# Altium project Medusa-AI-ESP.PrjPcb
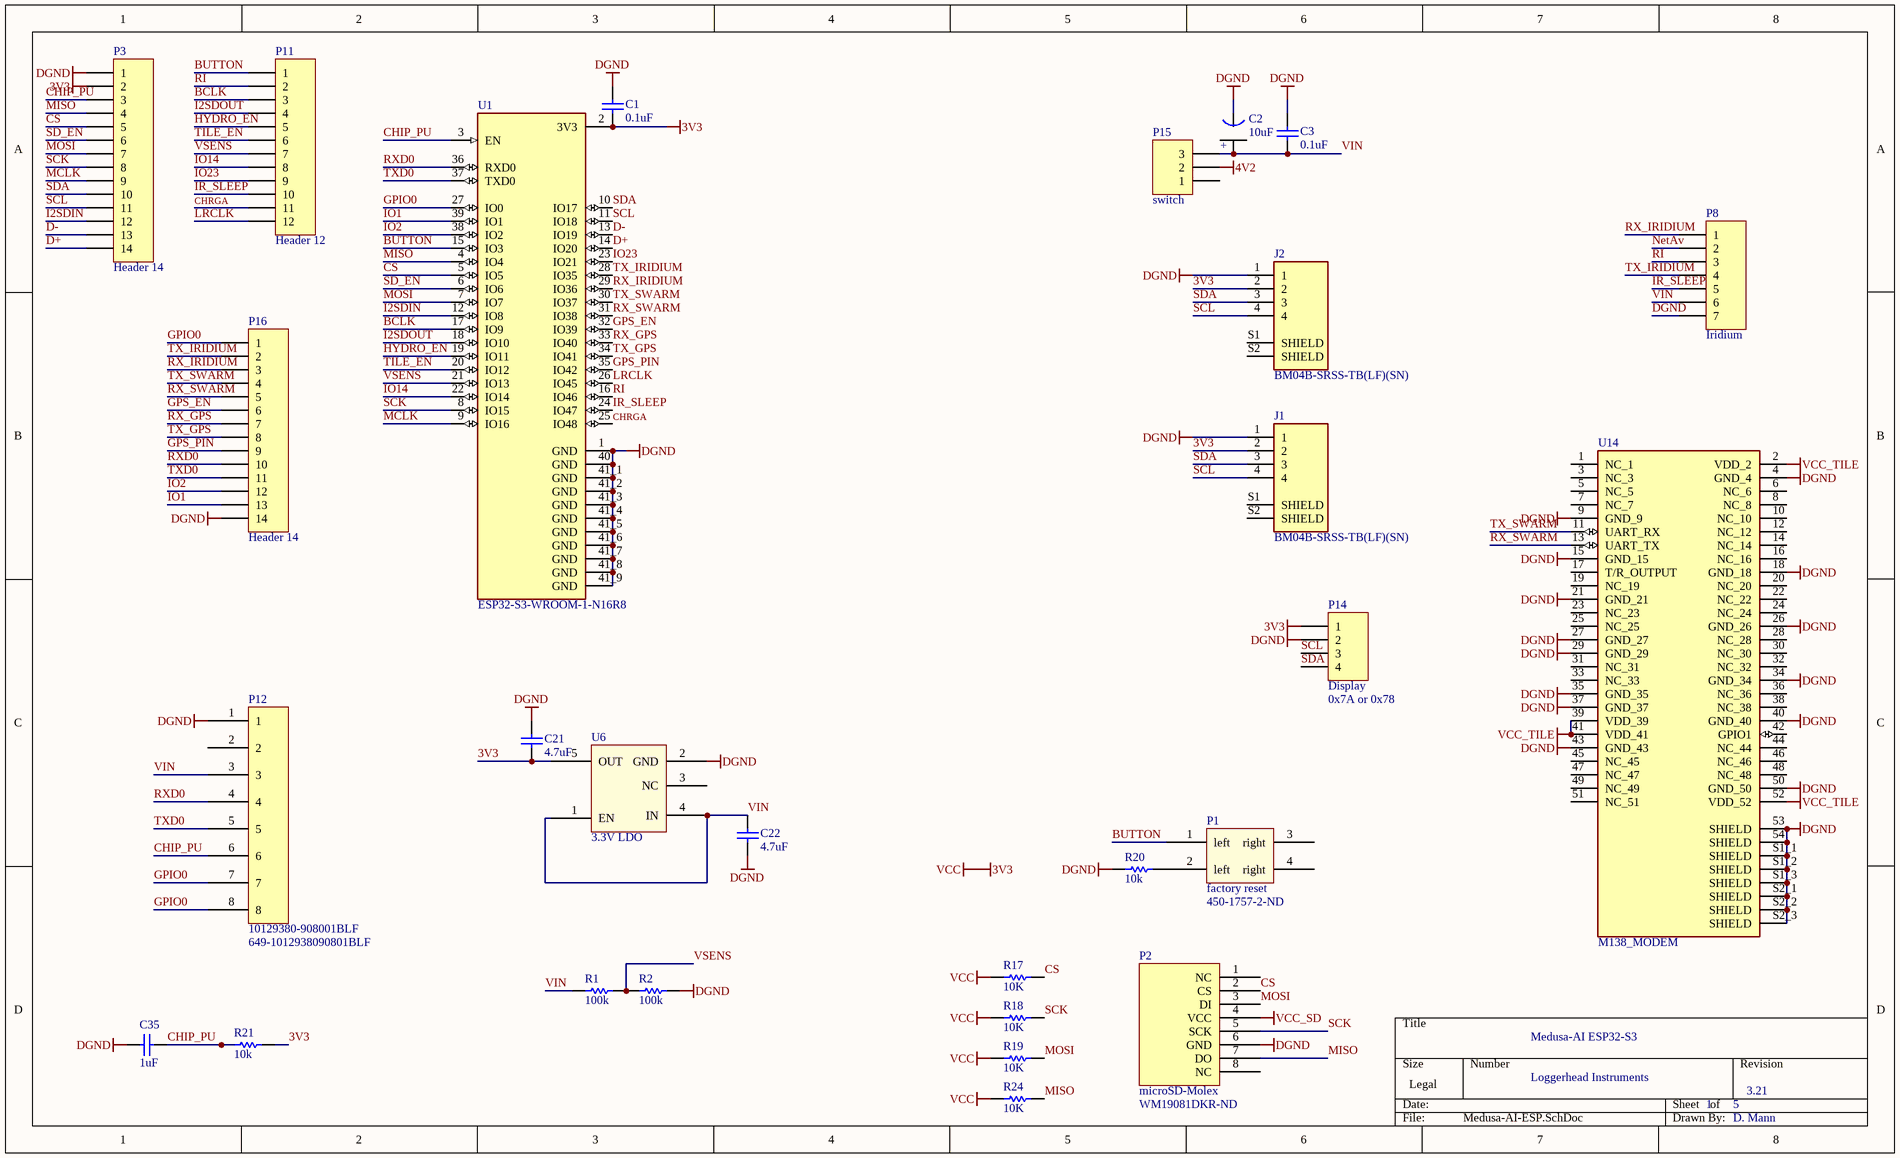
[diagram p0: Medusa-AI-ESP.SchDoc]
5 sheets, 124 parts. Net scope: global (net labels, ports and power ports of the same name join across sheets).
Board file: Medusa-AI-ESP.PcbDoc
Sheets:
  Medusa-AI-ESP.SchDoc
  medusa-ai-audio.SchDoc
  medusa-ai-power.SchDoc
  medusa-ai-sensors.SchDoc
  medusa-charger.SchDoc

## Sheet Medusa-AI-ESP.SchDoc
size Legal; SheetNumber: 1; SheetTotal: 5

### Parts
C1  0.1uF  [0402]
C2  10uF  [Tant0805]
C3  0.1uF  [0402]
C21  4.7uF  [0402]
C22  4.7uF  [0402]
C35  1uF  [0402]
J1  BM04B-SRSS-TB(LF)(SN)  [CONN_BM04B-SRSS-TB(LF)(SN)]
J2  BM04B-SRSS-TB(LF)(SN)  [CONN_BM04B-SRSS-TB(LF)(SN)]
P1  factory reset  Supplier Part Number 1: 450-1757-2-ND  [SOP4]
P2  microSD-Molex  Supplier Part Number 1: WM19081DKR-ND  [microSD_Molex_hinged]
P3  Header 14  [HDR1X14]
P8  Iridium  [HDR1X7]
P11  Header 12  [HDR1X12]
P12  10129380-908001BLF  Supplier Part Number 1: 649-1012938090801BLF  [Header_8_SMT]
P14  Display  [HDR1X4]
P15  switch  [HDR1X3]
P16  Header 14  [HDR1X14]
R1  100k  [3-0603]
R2  100k  [3-0603]
R17  10K  [3-0603]
R18  10K  [3-0603]
R19  10K  [3-0603]
R20  10k  [2-0402]
R21  10k  [2-0402]
R24  10K  [3-0603]
U1  ESP32-S3-WROOM-1-N16R8  [XCVR_ESP32-S3-WROOM-1-N16R2]
U6  3.3V LDO  [AP7361C-33Y5-13]
U14  M138_MODEM  [XCVR_M138_MODEM]

### Nets
3V3: C1.1 C21.2 J1.2 J2.2 P3.2 P14.1 R17.1 R18.1 R19.1 R21.1 R24.1 U1.2(3V3) U6.5(OUT)  [also labelled VCC]
4V2: P15.2
DGND: C1.2 C2.1(GND) C3.2 C21.1 C22.2 C35.2 J1.1 J2.1 P2.6(GND) P3.1 P8.7 P12.1 P14.2 P16.14 R2.1 R20.2 U1.1(GND) U1.40(GND) U1.41_1(GND) U1.41_2(GND) U1.41_3(GND) U1.41_4(GND) U1.41_5(GND) U1.41_6(GND) U1.41_7(GND) U1.41_8(GND) U1.41_9(GND) U6.2(GND) U14.4(GND_4) U14.9(GND_9) U14.15(GND_15) U14.18(GND_18) U14.21(GND_21) U14.26(GND_26) U14.27(GND_27) U14.29(GND_29) U14.34(GND_34) U14.35(GND_35) U14.37(GND_37) U14.40(GND_40) U14.43(GND_43) U14.50(GND_50) U14.53(SHIELD) U14.54(SHIELD) U14.S1_1(SHIELD) U14.S1_2(SHIELD) U14.S1_3(SHIELD) U14.S2_1(SHIELD) U14.S2_2(SHIELD) U14.S2_3(SHIELD)
VCC_SD: P2.4(VCC)
VCC_TILE: U14.2(VDD_2) U14.39(VDD_39) U14.41(VDD_41) U14.52(VDD_52)
BCLK: P11.3 U1.17(IO9)
BUTTON: P1.1(left) P11.1 U1.15(IO3)
CHIP_PU: C35.1 P3.3 P12.6 R21.2 U1.3(EN)
CHRGA: P11.11 U1.25(IO48)
CS: P2.2(CS) P3.5 R17.2 U1.5(IO5)
D+: P3.14 U1.14(IO20)
D-: P3.13 U1.13(IO19)
GPIO0: P12.7 P12.8 P16.1 U1.27(IO0)
GPS_EN: P16.6 U1.32(IO39)
GPS_PIN: P16.9 U1.35(IO42)
HYDRO_EN: P11.5 U1.19(IO11)
I2SDIN: P3.12 U1.12(IO8)
I2SDOUT: P11.4 U1.18(IO10)
IO1: P16.13 U1.39(IO1)
IO2: P16.12 U1.38(IO2)
IO14: P11.8 U1.22(IO14)
IO23: P11.9 U1.23(IO21)
IR_SLEEP: P8.5 P11.10 U1.24(IO47)
LRCLK: P11.12 U1.26(IO45)
MCLK: P3.9 U1.9(IO16)
MISO: P2.7(DO) P3.4 R24.2 U1.4(IO4)
MOSI: P2.3(DI) P3.7 R19.2 U1.7(IO7)
NetAv: P8.2
RI: P8.3 P11.2 U1.16(IO46)
RX_GPS: P16.7 U1.33(IO40)
RX_IRIDIUM: P8.1 P16.3 U1.29(IO36)
RX_SWARM: P16.5 U1.31(IO38) U14.13(UART_TX)
RXD0: P12.4 P16.10 U1.36(RXD0)
SCK: P2.5(SCK) P3.8 R18.2 U1.8(IO15)
SCL: J1.4 J2.4 P3.11 P14.3 U1.11(IO18)
SD_EN: P3.6 U1.6(IO6)
SDA: J1.3 J2.3 P3.10 P14.4 U1.10(IO17)
TILE_EN: P11.6 U1.20(IO12)
TX_GPS: P16.8 U1.34(IO41)
TX_IRIDIUM: P8.4 P16.2 U1.28(IO35)
TX_SWARM: P16.4 U1.30(IO37) U14.11(UART_RX)
TXD0: P12.5 P16.11 U1.37(TXD0)
VIN: C2.2(+) C3.1 C22.1 P8.6 P12.3 P15.3 R1.2 U6.1(EN) U6.4(IN)
VSENS: P11.7 R1.1 R2.2 U1.21(IO13)
NetP1_2: P1.2(left) R20.1

Not connected (* = marked no-connect by the designer): J1 S1(SHIELD) S2(SHIELD); J2 S1(SHIELD) S2(SHIELD); P1 3(right) 4(right); P2 1(NC) 8(NC); P12 2; P15 1; U6 3(NC); U14 1(NC_1) 3(NC_3) 5(NC_5) 6(NC_6) 7(NC_7) 8(NC_8) 10(NC_10) 12(NC_12) 14(NC_14) 16(NC_16) 17(T/R_OUTPUT) 19(NC_19) 20(NC_20) 22(NC_22) 23(NC_23) 24(NC_24) 25(NC_25) 28(NC_28) 30(NC_30) 31(NC_31) 32(NC_32) 33(NC_33) 36(NC_36) 38(NC_38) 42(GPIO1) 44(NC_44) 45(NC_45) 46(NC_46) 47(NC_47) 48(NC_48) 49(NC_49) 51(NC_51)

### Notes on the sheet
- (near P14) 0x7A or 0x78
- Medusa-AI ESP32-S3
- Loggerhead Instruments
- 1
- 5
- 3.21
- D. Mann

### Library data of the parts
C1 C3 = C0402: Ceramic Chip Capacitor - Standard; Note: Footprint corresponds to dimensions for bulk cassette packaging. This case size has tightened tolerances.; Published: 17-Jul-2002; LatestRevisionDate: 19-Mar-2004; LatestRevisionNote: Silkscreen size reduced.; DatasheetDocument: Mar-2001; PackageDocument: Mar-2001; PackageReference: 0402; Publisher: Altium Limited; Code_JEITA: 0402; Code_IPC: 1005 [0402]; ComponentLink1Description: Manufacturer Link; ComponentLink1URL: http://www.kemet.com/; ComponentLink2Description: Datasheet; ComponentLink2URL: http://www.kemet.com/kemet/web/homepage/kechome.nsf/vapubfilesname/F3102TA.pdf/$file/F3102TA.pdf; Value: 0.1uF
C2 = Tant0805: Value: 10uF
C21 C22 C35 = C0402: Ceramic Chip Capacitor - Standard; Note: Footprint corresponds to dimensions for bulk cassette packaging. This case size has tightened tolerances.; Value: 0.1uF; Published: 17-Jul-2002; LatestRevisionDate: 19-Mar-2004; LatestRevisionNote: Silkscreen size reduced.; DatasheetDocument: Mar-2001; PackageDocument: Mar-2001; PackageReference: 0402; Publisher: Altium Limited; Code_JEITA: 0402; Code_IPC: 1005 [0402]; ComponentLink1Description: Manufacturer Link; ComponentLink1URL: http://www.kemet.com/; ComponentLink2Description: Datasheet; ComponentLink2URL: http://www.kemet.com/kemet/web/homepage/kechome.nsf/vapubfilesname/F3102TA.pdf/$file/F3102TA.pdf
J1 J2 = BM04B-SRSS-TB(LF)(SN): Connector Header Surface Mount 4 position 0.039 _1.00mm_; MF: JST Sales; MP: BM04B-SRSS-TB_LF__SN_; Price: None; Availability: Unavailable; Package: None; SnapEDA_Link: https://www.snapeda.com/parts/BM04B-SRSS-TB%28LF%29%28SN%29/JST%20Sales%20America%20Inc./view-part/91778/?ref=snap; Value: *
P1 = pushbutton: Supplier 1: Digi-Key
P2 = microSD_Molex_hinged: Supplier 1: Digi-Key
P3 P16 = Header 14: Header, 14-Pin; LatestRevisionDate: 17-Jul-2002; LatestRevisionNote: Re-released for DXP Platform.; Publisher: Altium Limited
P8 = Header 7: Header, 7-Pin; LatestRevisionDate: 17-Jul-2002; LatestRevisionNote: Re-released for DXP Platform.; Publisher: Altium Limited
P11 = Header 12: Header, 12-Pin; LatestRevisionDate: 17-Jul-2002; LatestRevisionNote: Re-released for DXP Platform.; Publisher: Altium Limited
P12 = Header8_SMT: Surface mount header; Supplier 1: Mouser
P14 = Header 4: Header, 4-Pin; LatestRevisionDate: 17-Jul-2002; LatestRevisionNote: Re-released for DXP Platform.; Publisher: Altium Limited
P15 = Header 3: Header, 3-Pin; LatestRevisionDate: 17-Jul-2002; LatestRevisionNote: Re-released for DXP Platform.; Publisher: Altium Limited
R1 R2 = ERJ3RK: Precision Thick Film Chip Resistor, 10 Ohm to 1M Ohm Range, 1% and 0.5% Tolerance, 0603 Size, 0.063 W; Published: 17-Dec-2003; LatestRevisionDate: 19-Mar-2004; LatestRevisionNote: Silkscreen size reduced.; PackageDocument: Mar-2003; PackageReference: 3-0603; Publisher: Altium Limited; Code_IPC: 1608 [0603]; ComponentLink1Description: Manufacturer Link; ComponentLink1URL: http://www.panasonic.com/industrial/components/resistive_products.htm; ComponentLink2Description: Datasheet; ComponentLink2URL: http://www.panasonic.com/industrial/components/pdf/AOA0000CE2.pdf
R17-R19 R24 = ERJ3EK: Precision Thick Film Chip Resistor, 10 Ohm to 1M Ohm Range, 1% and 0.5% Tolerance, 0603 Size, 0.063 W; Published: 17-Dec-2003; LatestRevisionDate: 19-Mar-2004; LatestRevisionNote: Silkscreen size reduced.; PackageDocument: Mar-2003; PackageReference: 3-0603; Publisher: Altium Limited; Code_IPC: 1608 [0603]; ComponentLink1Description: Manufacturer Link; ComponentLink1URL: http://www.panasonic.com/industrial/components/resistive_products.htm; ComponentLink2Description: Datasheet; ComponentLink2URL: http://www.panasonic.com/industrial/components/pdf/AOA0000CE2.pdf
R20 R21 = ERJ2RB: Precision Thick Film Chip Resistor, 10 Ohm to 1M Ohm Range, 1% and 0.5% Tolerance, 0402 Size, 0.063 W; Published: 17-Dec-2003; LatestRevisionDate: 19-Mar-2004; LatestRevisionNote: Silkscreen size reduced.; PackageDocument: Mar-2003; PackageReference: 2-0402; Publisher: Altium Limited; Code_IPC: 1005 [0402]; ComponentLink1Description: Manufacturer Link; ComponentLink1URL: http://www.panasonic.com/industrial/components/resistive_products.htm; ComponentLink2Description: Datasheet; ComponentLink2URL: http://www.panasonic.com/industrial/components/pdf/AOA0000CE2.pdf
U1 = ESP32-S3-WROOM-1-N16R2: Bluetooth, WiFi 802.11b/g/n, Bluetooth v5.0 Transceiver Module 2.4GHz PCB Trace Surface Mount; MF: Espressif Systems; Package: None; Availability: In Stock; SnapEDA_Link: https://www.snapeda.com/parts/ESP32-S3-WROOM-1-N16R2/Espressif+Systems/view-part/?ref=snap; MP: ESP32-S3-WROOM-1-N16R2; Value: *; Purchase-URL: https://pricing.snapeda.com/search/part/ESP32-S3-WROOM-1-N16R2/?ref=eda; Price: None; Check_prices: https://www.snapeda.com/parts/ESP32-S3-WROOM-1-N16R2/Espressif+Systems/view-part/?ref=eda
U6 = AP7361C-33Y5-13
U14 = M138_MODEM: Swarm M138 Modem; MF: Swarm; Check_prices: https://www.snapeda.com/parts/M138%20Modem/Swarm/view-part/?ref=eda; Value: *; Package: Package; Price: None; Availability: Not in stock; MP: M138 Modem; SnapEDA_Link: https://www.snapeda.com/parts/M138%20Modem/Swarm/view-part/?ref=snap

## Sheet medusa-ai-audio.SchDoc
size Legal; SheetNumber: 2; SheetTotal: 5
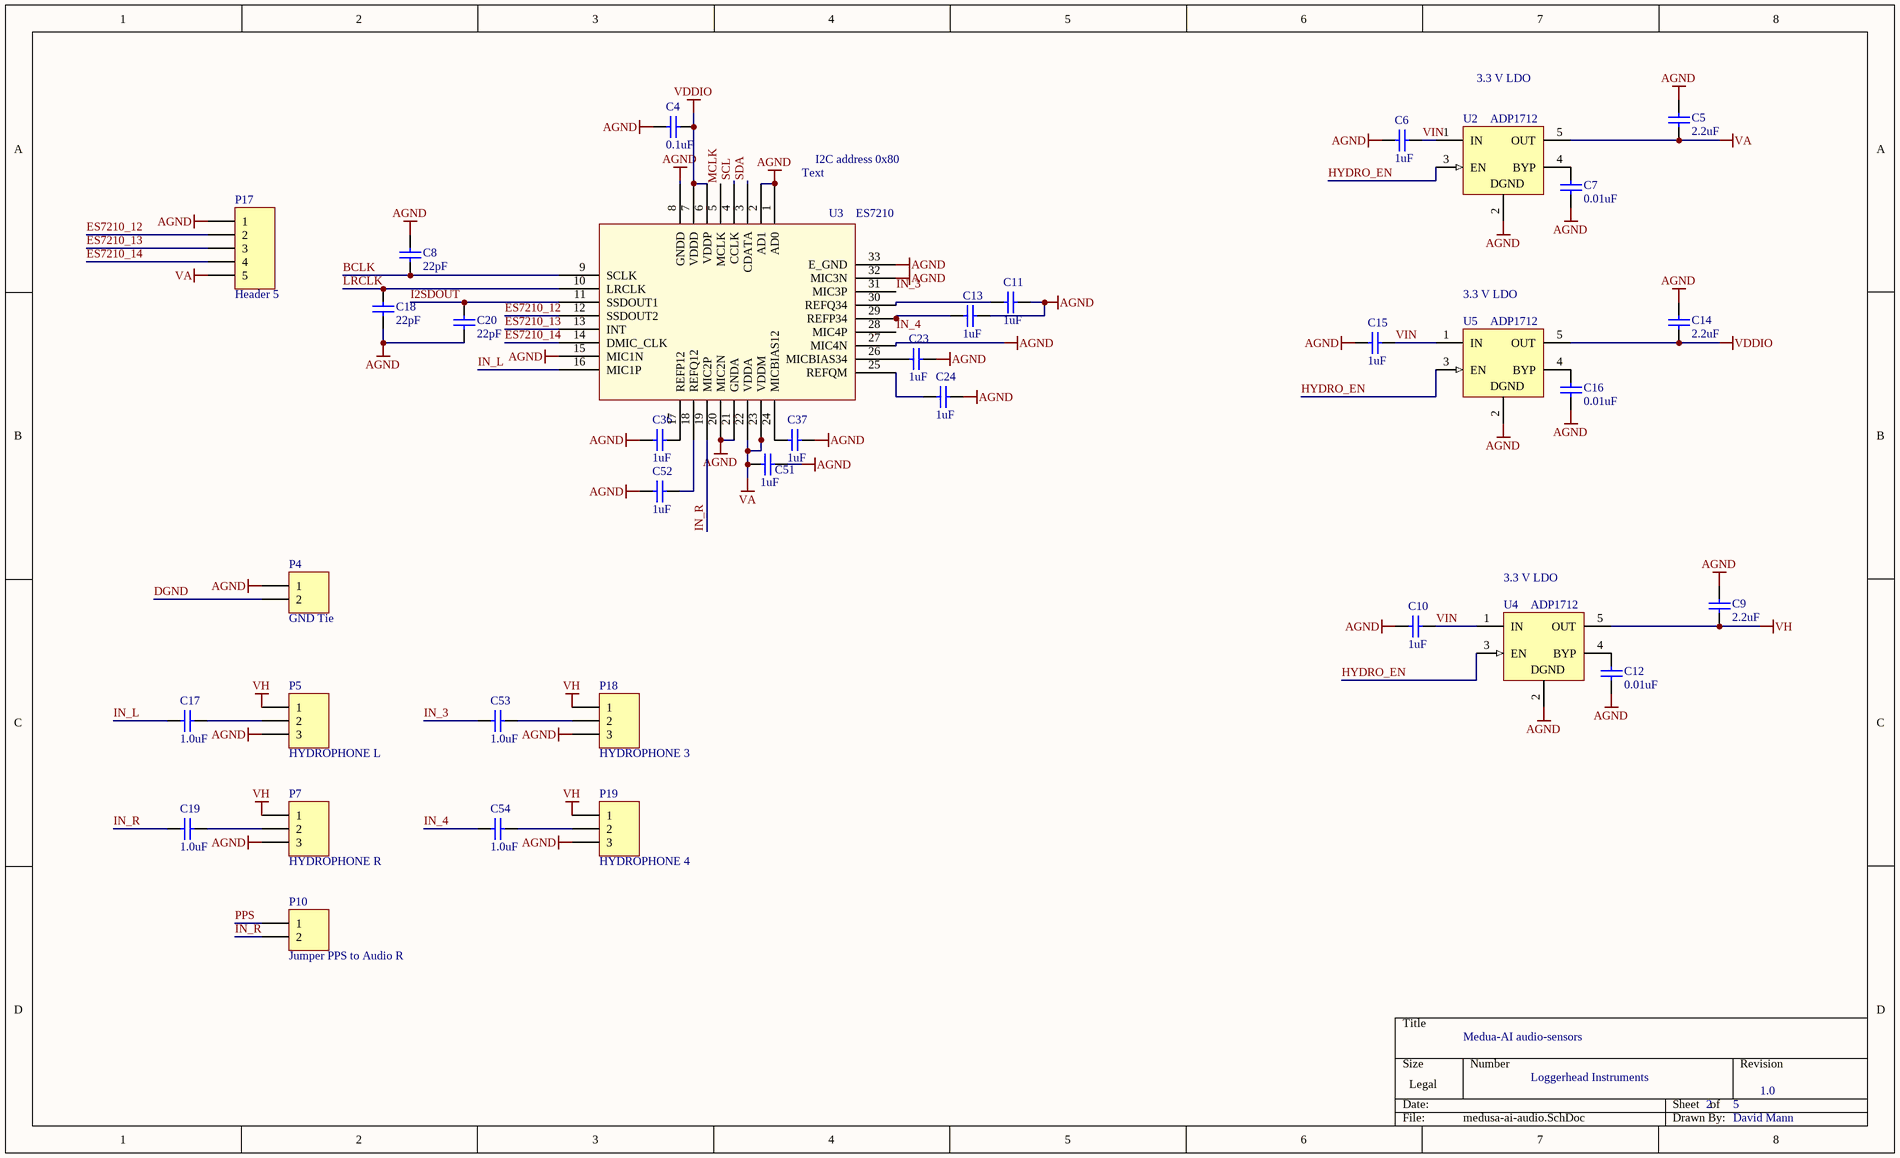
[diagram p1: medusa-ai-audio.SchDoc]

### Parts
C4  0.1uF  [0402]
C5  2.2uF  [0402]
C6  1uF  [0402]
C7  0.01uF  [0402]
C8  22pF  [0402]
C9  2.2uF  [0402]
C10  1uF  [0402]
C11  1uF  [0402]
C12  0.01uF  [0402]
C13  1uF  [0402]
C14  2.2uF  [0402]
C15  1uF  [0402]
C16  0.01uF  [0402]
C17  1.0uF  [0402]
C18  22pF  [0402]
C19  1.0uF  [0402]
C20  22pF  [0402]
C23  1uF  [0402]
C24  1uF  [0402]
C36  1uF  [0402]
C37  1uF  [0402]
C51  1uF  [0402]
C52  1uF  [0402]
C53  1.0uF  [0402]
C54  1.0uF  [0402]
P4  GND Tie  [HDR1X2]
P5  HYDROPHONE L  [HDR1X3]
P7  HYDROPHONE R  [HDR1X3]
P10  Jumper PPS to Audio R  [HDR1X2]
P17  Header 5  [HDR1X5]
P18  HYDROPHONE 3  [HDR1X3]
P19  HYDROPHONE 4  [HDR1X3]
U2  ADP1712  [MF05A_N]
U3  ES7210  [ES7210]
U4  ADP1712  [MF05A_N]
U5  ADP1712  [MF05A_N]

### Nets
AGND: C4.1 C5.2 C6.2 C7.2 C8.1 C9.2 C10.2 C11.1 C12.2 C13.1 C14.2 C15.2 C16.2 C18.2 C20.2 C23.1 C24.1 C36.2 C37.1 C51.1 C52.1 P4.1 P5.3 P7.3 P17.1 P18.3 P19.3 U2.2(GND) U3.1(AD0) U3.2(AD1) U3.8(GNDD) U3.15(MIC1N) U3.20(MIC2N) U3.21(GNDA) U3.27(MIC4N) U3.32(MIC3N) U3.33(E_GND) U4.2(GND) U5.2(GND)
DGND: P4.2
VA: C5.1 C51.2 P17.5 U2.5(OUT) U3.22(VDDA) U3.23(VDDM)
VDDIO: C4.2 C14.1 U3.6(VDDP) U3.7(VDDD) U5.5(OUT)
VH: C9.1 P5.1 P7.1 P18.1 P19.1 U4.5(OUT)
BCLK: C8.2 U3.9(SCLK)
ES7210_12: P17.2 U3.12(SSDOUT2)
ES7210_13: P17.3 U3.13(INT)
ES7210_14: P17.4 U3.14(DMIC_CLK)
HYDRO_EN: U2.3(EN) U4.3(EN) U5.3(EN)
I2SDOUT: C20.1 U3.11(SSDOUT1)
IN_3: C53.2 U3.31(MIC3P)
IN_4: C54.2 U3.28(MIC4P)
IN_L: C17.2 U3.16(MIC1P)
IN_R: C19.2 P10.2 U3.19(MIC2P)
LRCLK: C18.1 U3.10(LRCLK)
MCLK: U3.5(MCLK)
PPS: P10.1
SCL: U3.4(CCLK)
SDA: U3.3(CDATA)
VIN: C6.1 C10.1 C15.1 U2.1(IN) U4.1(IN) U5.1(IN)
NetC7_1: C7.1 U2.4(BYP)
NetC11_2: C11.2 U3.30(REFQ34)
NetC12_1: C12.1 U4.4(BYP)
NetC13_2: C13.2 U3.29(REFP34)
NetC16_1: C16.1 U5.4(BYP)
NetC17_1: C17.1 P5.2
NetC19_1: C19.1 P7.2
NetC23_2: C23.2 U3.26(MICBIAS34)
NetC24_2: C24.2 U3.25(REFQM)
NetC36_1: C36.1 U3.17(REFP12)
NetC37_2: C37.2 U3.24(MICBIAS12)
NetC52_2: C52.2 U3.18(REFQ12)
NetC53_1: C53.1 P18.2
NetC54_1: C54.1 P19.2

### Notes on the sheet
- 3.3 V LDO
- I2C address 0x80
- (near U3) Text
- (near U5) 3.3 V LDO
- (near U4) 3.3 V LDO
- Medua-AI audio-sensors
- Loggerhead Instruments
- 2
- 5
- 1.0
- David Mann
- (in symbol LP3985IM5-3.3) DGND

### Library data of the parts
C4 = C0402: as C1 on sheet Medusa-AI-ESP; Published: 17-Jul-2002; LatestRevisionDate: 19-Mar-2004; LatestRevisionNote: Silkscreen size reduced.; DatasheetDocument: Mar-2001; PackageDocument: Mar-2001; PackageReference: 0402; Publisher: Altium Limited; Code_JEITA: 0402; Code_IPC: 1005 [0402]; ComponentLink1Description: Manufacturer Link; ComponentLink1URL: http://www.kemet.com/; ComponentLink2Description: Datasheet; ComponentLink2URL: http://www.kemet.com/kemet/web/homepage/kechome.nsf/vapubfilesname/F3102TA.pdf/$file/F3102TA.pdf; Value: 0.1uF
C5-C20 C23 C24 C36 C37 C51-C54 = C0402: as C21 on sheet Medusa-AI-ESP; Published: 17-Jul-2002; LatestRevisionDate: 19-Mar-2004; LatestRevisionNote: Silkscreen size reduced.; DatasheetDocument: Mar-2001; PackageDocument: Mar-2001; PackageReference: 0402; Publisher: Altium Limited; Code_JEITA: 0402; Code_IPC: 1005 [0402]; ComponentLink1Description: Manufacturer Link; ComponentLink1URL: http://www.kemet.com/; ComponentLink2Description: Datasheet; ComponentLink2URL: http://www.kemet.com/kemet/web/homepage/kechome.nsf/vapubfilesname/F3102TA.pdf/$file/F3102TA.pdf
P4 P10 = Header 2: Header, 2-Pin; LatestRevisionDate: 17-Jul-2002; LatestRevisionNote: Re-released for DXP Platform.; Publisher: Altium Limited
P5 P7 P18 P19 = Header 3: Header, 3-Pin; LatestRevisionDate: 17-Jul-2002; LatestRevisionNote: Re-released for DXP Platform.; Publisher: Altium Limited
P17 = Header 5: Header, 5-Pin; LatestRevisionDate: 17-Jul-2002; LatestRevisionNote: Re-released for DXP Platform.; Publisher: Altium Limited
U2 U4 U5 = LP3985IM5-3.3: Micropower, 150mA Low-Noise Ultra Low-Dropout CMOS Voltage Regulator; Manufacturer: National Semiconductor; CompType: LDO IC; PackageTopMarking: LDQB*XTT; PowerWise: N; Published: 4-Dec-2008; DatasheetVersion: Aug-2005; PackageVersion: revD, Aug-2008; PackageReference: MF05A; Publisher: Altium Limited; PackageDescription: Molded SOT-23, .115 x .063 x .040 in Body, 5 Lead, .0375 in Pitch; PartNumber: LP3985IM5-3.3; RoHS: O; PinCount: 5; DigiKeyPartNumber: LP3985IM5-3.3CT-ND; ComponentLink1Description: LP3985 Datasheet; ComponentLink1URL: http://www.national.com/ds/LP/LP3985.pdf; ComponentLink2Description: LP3985 Web Page; ComponentLink2URL: http://www.national.com/pf/LP/LP3985.html; ComponentLink3Description: MF05A Package Page; ComponentLink3URL: http://www.national.com/packaging/folders/mf05a.html
U3 = ES7210: Audio CODEC

## Sheet medusa-ai-power.SchDoc
size Legal; SheetNumber: 3; SheetTotal: 4
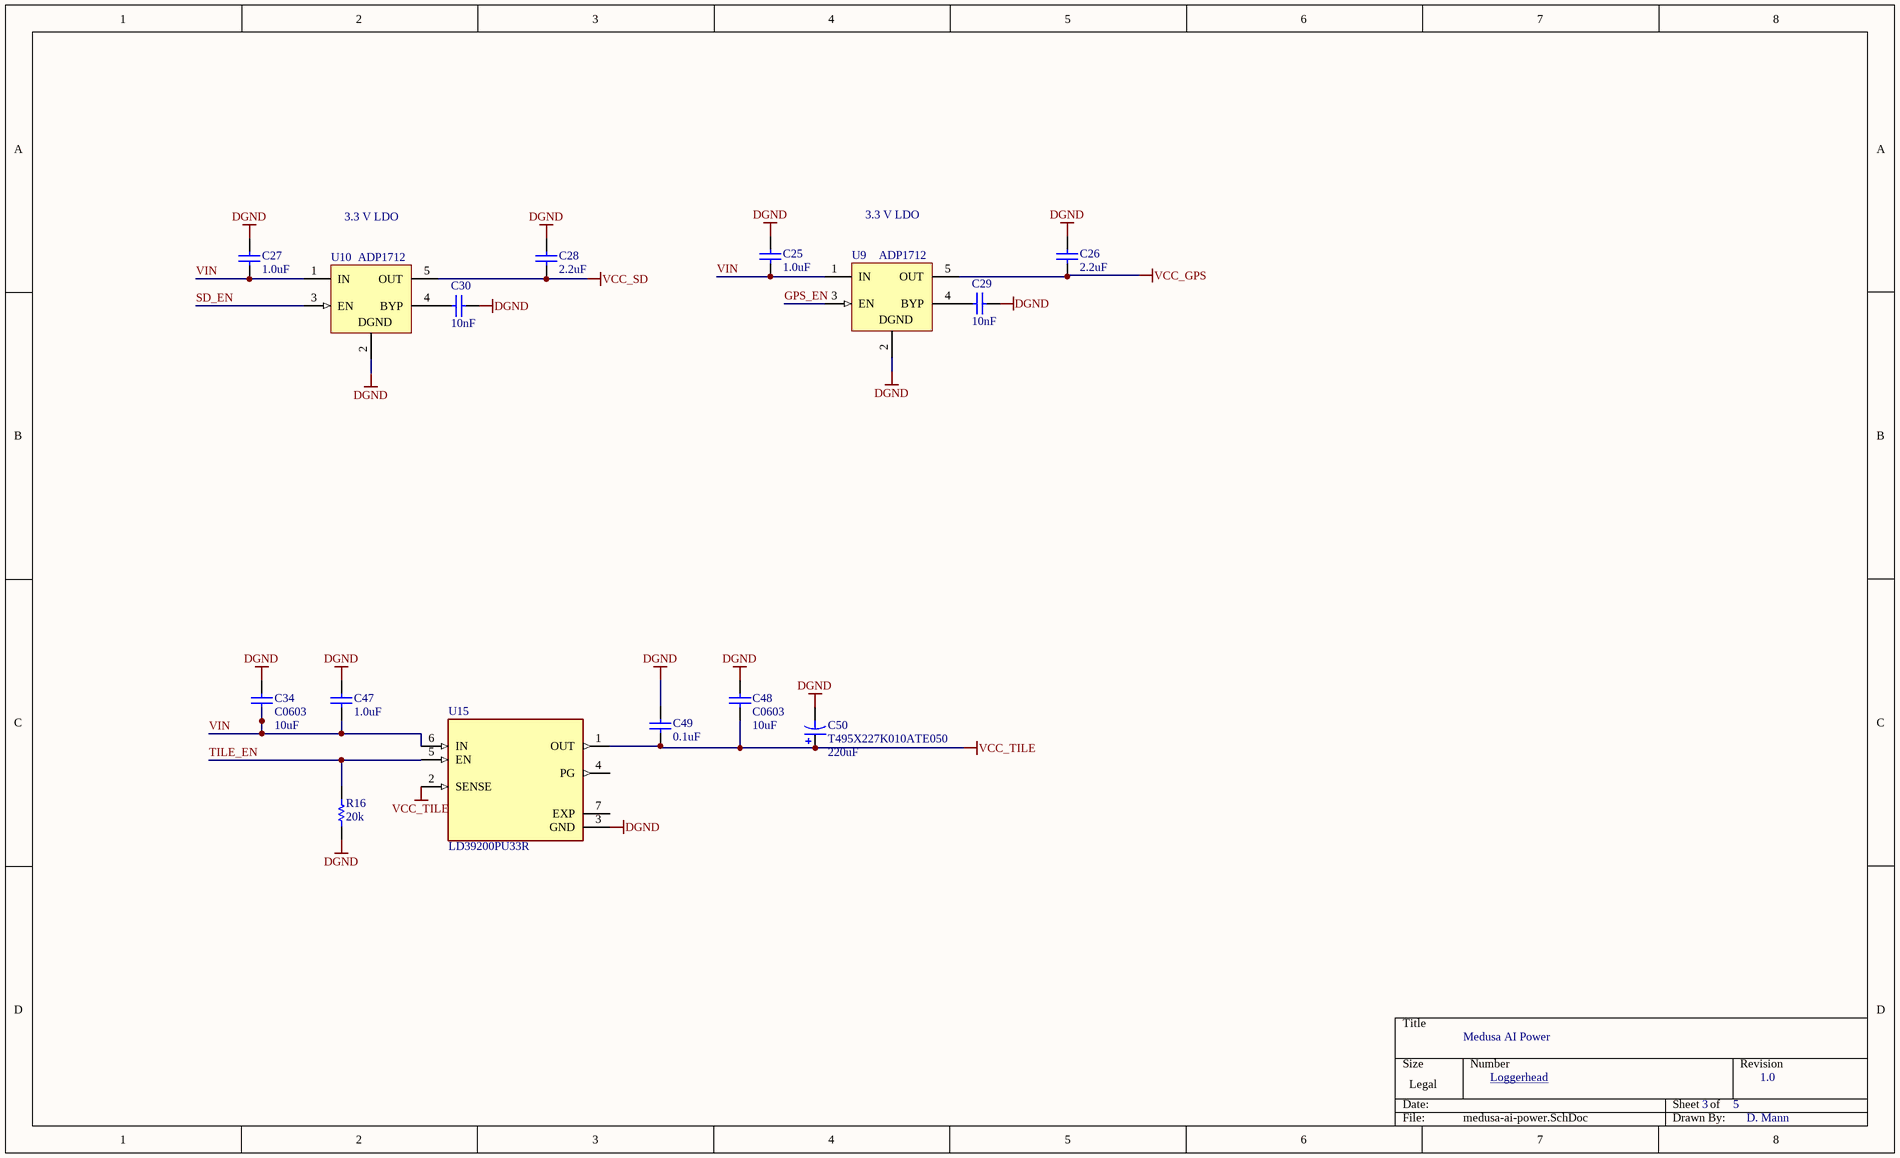
[diagram p2: medusa-ai-power.SchDoc]

### Parts
C25  1.0uF  [0402]
C26  2.2uF  [0402]
C27  1.0uF  [0402]
C28  2.2uF  [0402]
C29  10nF  [0402]
C30  10nF  [0402]
C34  C0603  value 10uF  [0603]
C47  1.0uF  [0402]
C48  C0603  value 10uF  [0603]
C49  0.1uF  [0402]
C50  T495X227K010ATE050  value 220uF  [X]
R16  20k  [3-0603]
U9  ADP1712  [MF05A_N]
U10  ADP1712  [MF05A_N]
U15  LD39200PU33R  [SON95P300X300X100-7N]

### Nets
DGND: C25.2 C26.2 C27.2 C28.2 C29.1 C30.1 C34.1 C47.2 C48.1 C49.2 C50.2 R16.2 U9.2(GND) U10.2(GND) U15.3(GND)
VCC_GPS: C26.1 U9.5(OUT)
VCC_SD: C28.1 U10.5(OUT)
VCC_TILE: C48.2 C49.1 C50.1 U15.1(OUT) U15.2(SENSE)
GPS_EN: U9.3(EN)
SD_EN: U10.3(EN)
TILE_EN: R16.1 U15.5(EN)
VIN: C25.1 C27.1 C34.2 C47.1 U9.1(IN) U10.1(IN) U15.6(IN)
NetC29_2: C29.2 U9.4(BYP)
NetC30_2: C30.2 U10.4(BYP)

Not connected (* = marked no-connect by the designer): U15 4(PG) 7(EXP)

### Notes on the sheet
- 3.3 V LDO
- Medusa AI Power
- Loggerhead
- 3
- 5
- 1.0
- D. Mann
- (in symbol LP3985IM5-3.3) DGND

### Library data of the parts
C25-C30 C47 = C0402: as C21 on sheet Medusa-AI-ESP; Published: 17-Jul-2002; LatestRevisionDate: 19-Mar-2004; LatestRevisionNote: Silkscreen size reduced.; DatasheetDocument: Mar-2001; PackageDocument: Mar-2001; PackageReference: 0402; Publisher: Altium Limited; Code_JEITA: 0402; Code_IPC: 1005 [0402]; ComponentLink1Description: Manufacturer Link; ComponentLink1URL: http://www.kemet.com/; ComponentLink2Description: Datasheet; ComponentLink2URL: http://www.kemet.com/kemet/web/homepage/kechome.nsf/vapubfilesname/F3102TA.pdf/$file/F3102TA.pdf
C34 C48 = C0603: Ceramic Chip Capacitor - Standard; Note: Footprint corresponds to dimensions for bulk cassette packaging. This case size has tightened tolerances.; Published: 17-Jul-2002; LatestRevisionDate: 19-Mar-2004; LatestRevisionNote: Silkscreen size reduced.; DatasheetDocument: Mar-2001; PackageDocument: Mar-2001; PackageReference: 0603; Publisher: Altium Limited; Code_JEITA: 0603; Code_IPC: 1608 [0603]; ComponentLink1Description: Manufacturer Link; ComponentLink1URL: http://www.kemet.com/; ComponentLink2Description: Datasheet; ComponentLink2URL: http://www.kemet.com/kemet/web/homepage/kechome.nsf/vapubfilesname/F3102TA.pdf/$file/F3102TA.pdf
C49 = C0402: as C1 on sheet Medusa-AI-ESP; Published: 17-Jul-2002; LatestRevisionDate: 19-Mar-2004; LatestRevisionNote: Silkscreen size reduced.; DatasheetDocument: Mar-2001; PackageDocument: Mar-2001; PackageReference: 0402; Publisher: Altium Limited; Code_JEITA: 0402; Code_IPC: 1005 [0402]; ComponentLink1Description: Manufacturer Link; ComponentLink1URL: http://www.kemet.com/; ComponentLink2Description: Datasheet; ComponentLink2URL: http://www.kemet.com/kemet/web/homepage/kechome.nsf/vapubfilesname/F3102TA.pdf/$file/F3102TA.pdf; Value: 0.1uF
C50 = T495X: Solid Tantalum Chip Capacitor, Standard T495 Series - Low ESR, Surge Robust; PCB_Layout: Round Glue Pad at 2.9 ±0.1mm in diameter at KEMET's option; Published: 17-Jul-2002; LatestRevisionDate: 19-Mar-2004; LatestRevisionNote: Silkscreen dimensions re-sized.; DatasheetDocument: Mar-2001; PackageDocument: Mar-2001; PackageReference: X; Publisher: Altium Limited; Code_JEITA: 7343-43; ComponentLink1Description: Manufacturer Link; ComponentLink1URL: http://www.kemet.com/; ComponentLink2Description: Datasheet; ComponentLink2URL: http://www.kemet.com/kemet/web/homepage/kechome.nsf/vapubfilesname/F3102TA.pdf/$file/F3102TA.pdf
R16 = ERJ3RK: as R1 on sheet Medusa-AI-ESP; Published: 17-Dec-2003; LatestRevisionDate: 19-Mar-2004; LatestRevisionNote: Silkscreen size reduced.; PackageDocument: Mar-2003; PackageReference: 3-0603; Publisher: Altium Limited; Code_IPC: 1608 [0603]; ComponentLink1Description: Manufacturer Link; ComponentLink1URL: http://www.panasonic.com/industrial/components/resistive_products.htm; ComponentLink2Description: Datasheet; ComponentLink2URL: http://www.panasonic.com/industrial/components/pdf/AOA0000CE2.pdf
U9 U10 = LP3985IM5-3.3: as U2 on sheet medusa-ai-audio; Published: 4-Dec-2008; DatasheetVersion: Aug-2005; PackageVersion: revD, Aug-2008; PackageReference: MF05A; Publisher: Altium Limited; PackageDescription: Molded SOT-23, .115 x .063 x .040 in Body, 5 Lead, .0375 in Pitch; PartNumber: LP3985IM5-3.3; RoHS: O; PinCount: 5; DigiKeyPartNumber: LP3985IM5-3.3CT-ND; ComponentLink1Description: LP3985 Datasheet; ComponentLink1URL: http://www.national.com/ds/LP/LP3985.pdf; ComponentLink2Description: LP3985 Web Page; ComponentLink2URL: http://www.national.com/pf/LP/LP3985.html; ComponentLink3Description: MF05A Package Page; ComponentLink3URL: http://www.national.com/packaging/folders/mf05a.html
U15 = LD39200PU33R: Linear Voltage Regulator IC 1 Output 2A 6-DFN _3x3_; MF: STMicroelectronics; Package: DFN-6 STMicroelectronics; SnapEDA_Link: https://www.snapeda.com/parts/LD39200PU33R/STMicroelectronics/view-part/482679/?ref=snap; MP: LD39200PU33R; Value: *; Availability: Unavailable; Price: None

## Sheet medusa-ai-sensors.SchDoc
size Legal; SheetNumber: 4; SheetTotal: 5
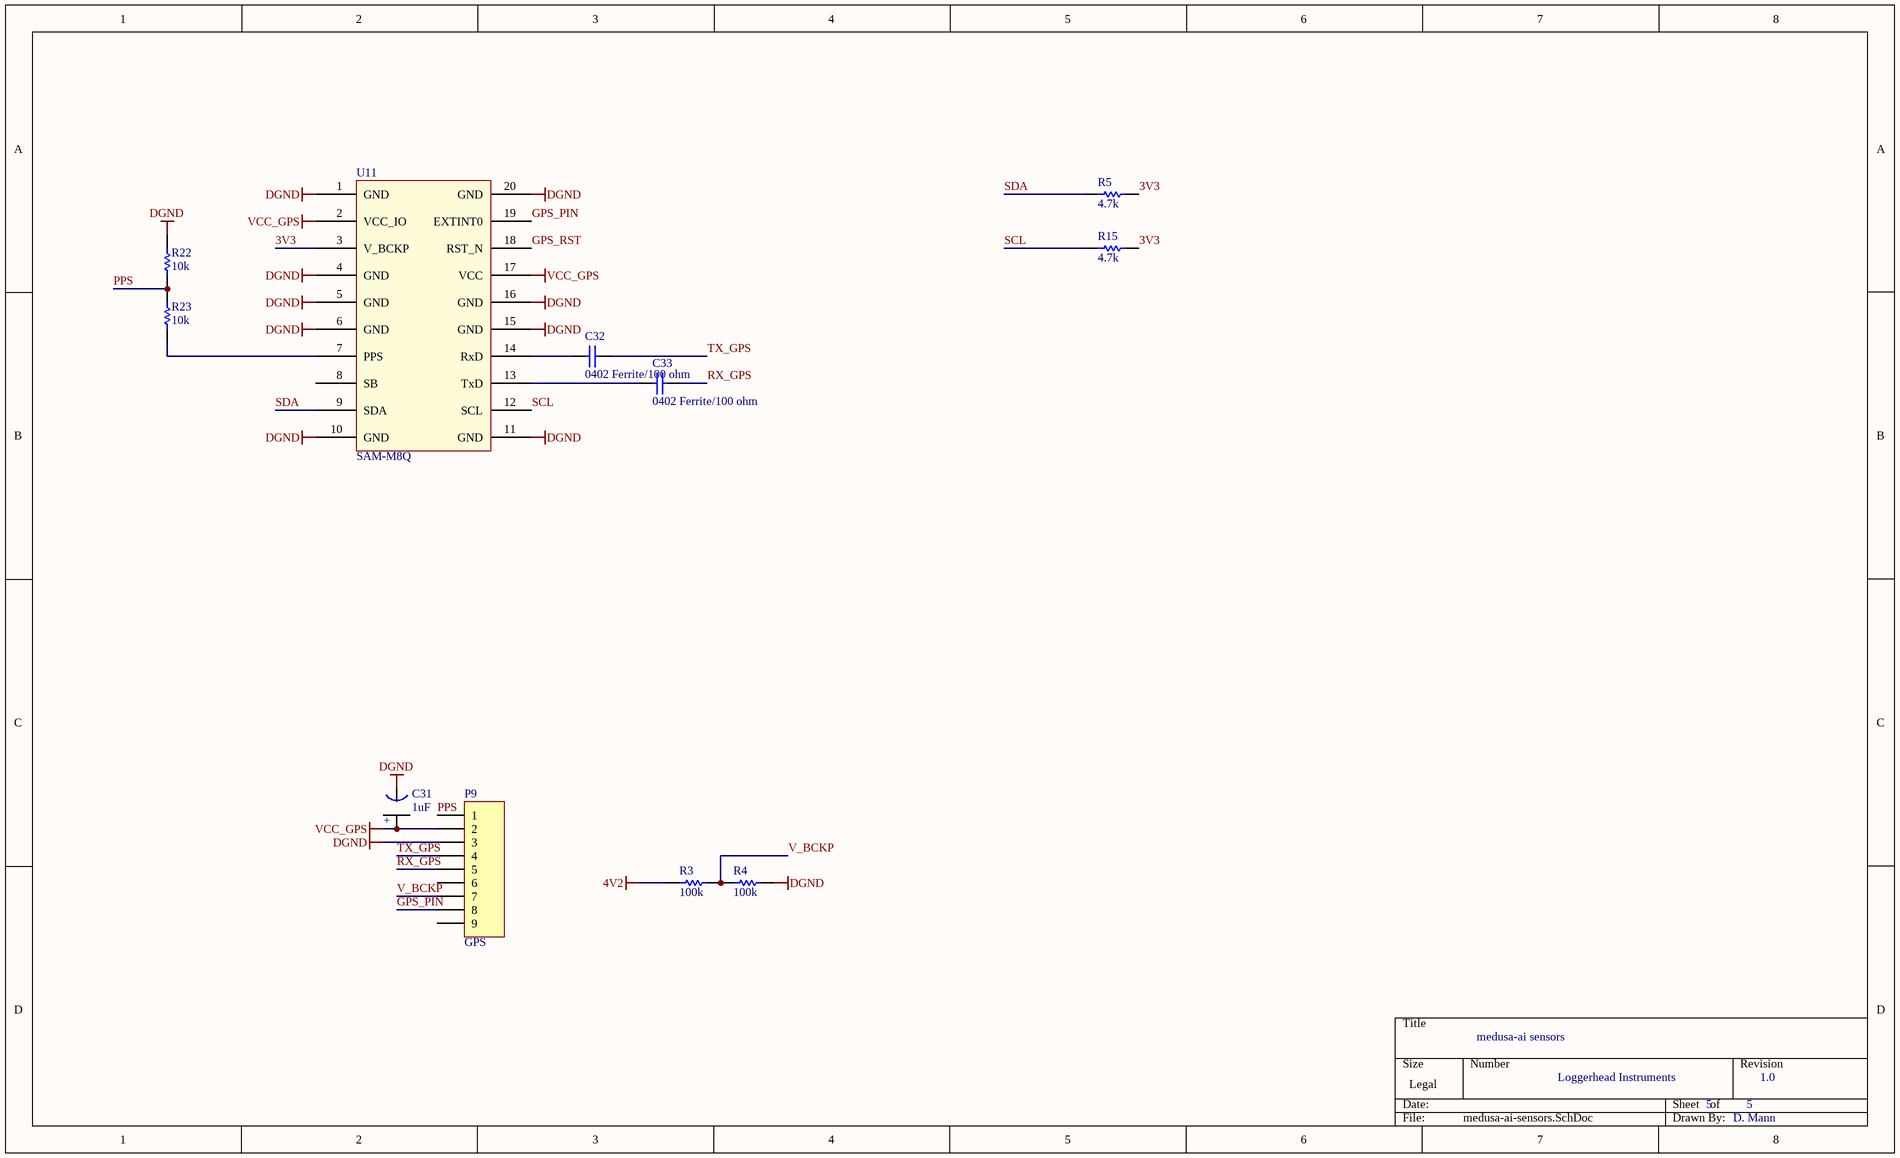
[diagram p3: medusa-ai-sensors.SchDoc]

### Parts
C31  1uF  [Tant0805]
C32  0402 Ferrite/100 ohm  [0402]
C33  0402 Ferrite/100 ohm  [0402]
P9  GPS  [HDR1X9]
R3  100k  [3-0603]
R4  100k  [3-0603]
R5  4.7k  [3-0603]
R15  4.7k  [3-0603]
R22  10k  [3-0603]
R23  10k  [3-0603]
U11  SAM-M8Q  [GPS SAM-MQ8]

### Nets
3V3: R5.2 R15.2 U11.3(V_BCKP)
4V2: R3.2
DGND: C31.1(GND) P9.3 R4.1 R22.1 U11.1(GND) U11.4(GND) U11.5(GND) U11.6(GND) U11.10(GND) U11.11(GND) U11.15(GND) U11.16(GND) U11.20(GND)
VCC_GPS: C31.2(+) P9.2 U11.2(VCC_IO) U11.17(VCC)
GPS_PIN: P9.8 U11.19(EXTINT0)
GPS_RST: U11.18(RST_N)
PPS: P9.1 R22.2 R23.1
RX_GPS: C33.2 P9.5
SCL: R15.1 U11.12(SCL)
SDA: R5.1 U11.9(SDA)
TX_GPS: C32.2 P9.4
V_BCKP: P9.7 R3.1 R4.2
NetC32_1: C32.1 U11.14(RxD)
NetC33_1: C33.1 U11.13(TxD)
NetR23_2: R23.2 U11.7(PPS)

Not connected (* = marked no-connect by the designer): P9 6 9; U11 8(SB)

### Notes on the sheet
- medusa-ai sensors
- Loggerhead Instruments
- 5
- 1.0
- D. Mann

### Library data of the parts
C31 = Tant0805: Value: 1uF
C32 C33 = C0402: Ceramic Chip Capacitor - Standard; Note: Footprint corresponds to dimensions for bulk cassette packaging. This case size has tightened tolerances.; Value: 100pF; Published: 17-Jul-2002; LatestRevisionDate: 19-Mar-2004; LatestRevisionNote: Silkscreen size reduced.; DatasheetDocument: Mar-2001; PackageDocument: Mar-2001; PackageReference: 0402; Publisher: Altium Limited; Code_JEITA: 0402; Code_IPC: 1005 [0402]; ComponentLink1Description: Manufacturer Link; ComponentLink1URL: http://www.kemet.com/; ComponentLink2Description: Datasheet; ComponentLink2URL: http://www.kemet.com/kemet/web/homepage/kechome.nsf/vapubfilesname/F3102TA.pdf/$file/F3102TA.pdf
P9 = Header 9: Header, 9-Pin; LatestRevisionDate: 17-Jul-2002; LatestRevisionNote: Re-released for DXP Platform.; Publisher: Altium Limited
R3-R5 R15 R22 R23 = ERJ3RK: as R1 on sheet Medusa-AI-ESP; Published: 17-Dec-2003; LatestRevisionDate: 19-Mar-2004; LatestRevisionNote: Silkscreen size reduced.; PackageDocument: Mar-2003; PackageReference: 3-0603; Publisher: Altium Limited; Code_IPC: 1608 [0603]; ComponentLink1Description: Manufacturer Link; ComponentLink1URL: http://www.panasonic.com/industrial/components/resistive_products.htm; ComponentLink2Description: Datasheet; ComponentLink2URL: http://www.panasonic.com/industrial/components/pdf/AOA0000CE2.pdf
U11 = GPS SAM-M8Q

## Sheet medusa-charger.SchDoc
size Legal; SheetNumber: 5; SheetTotal: 5
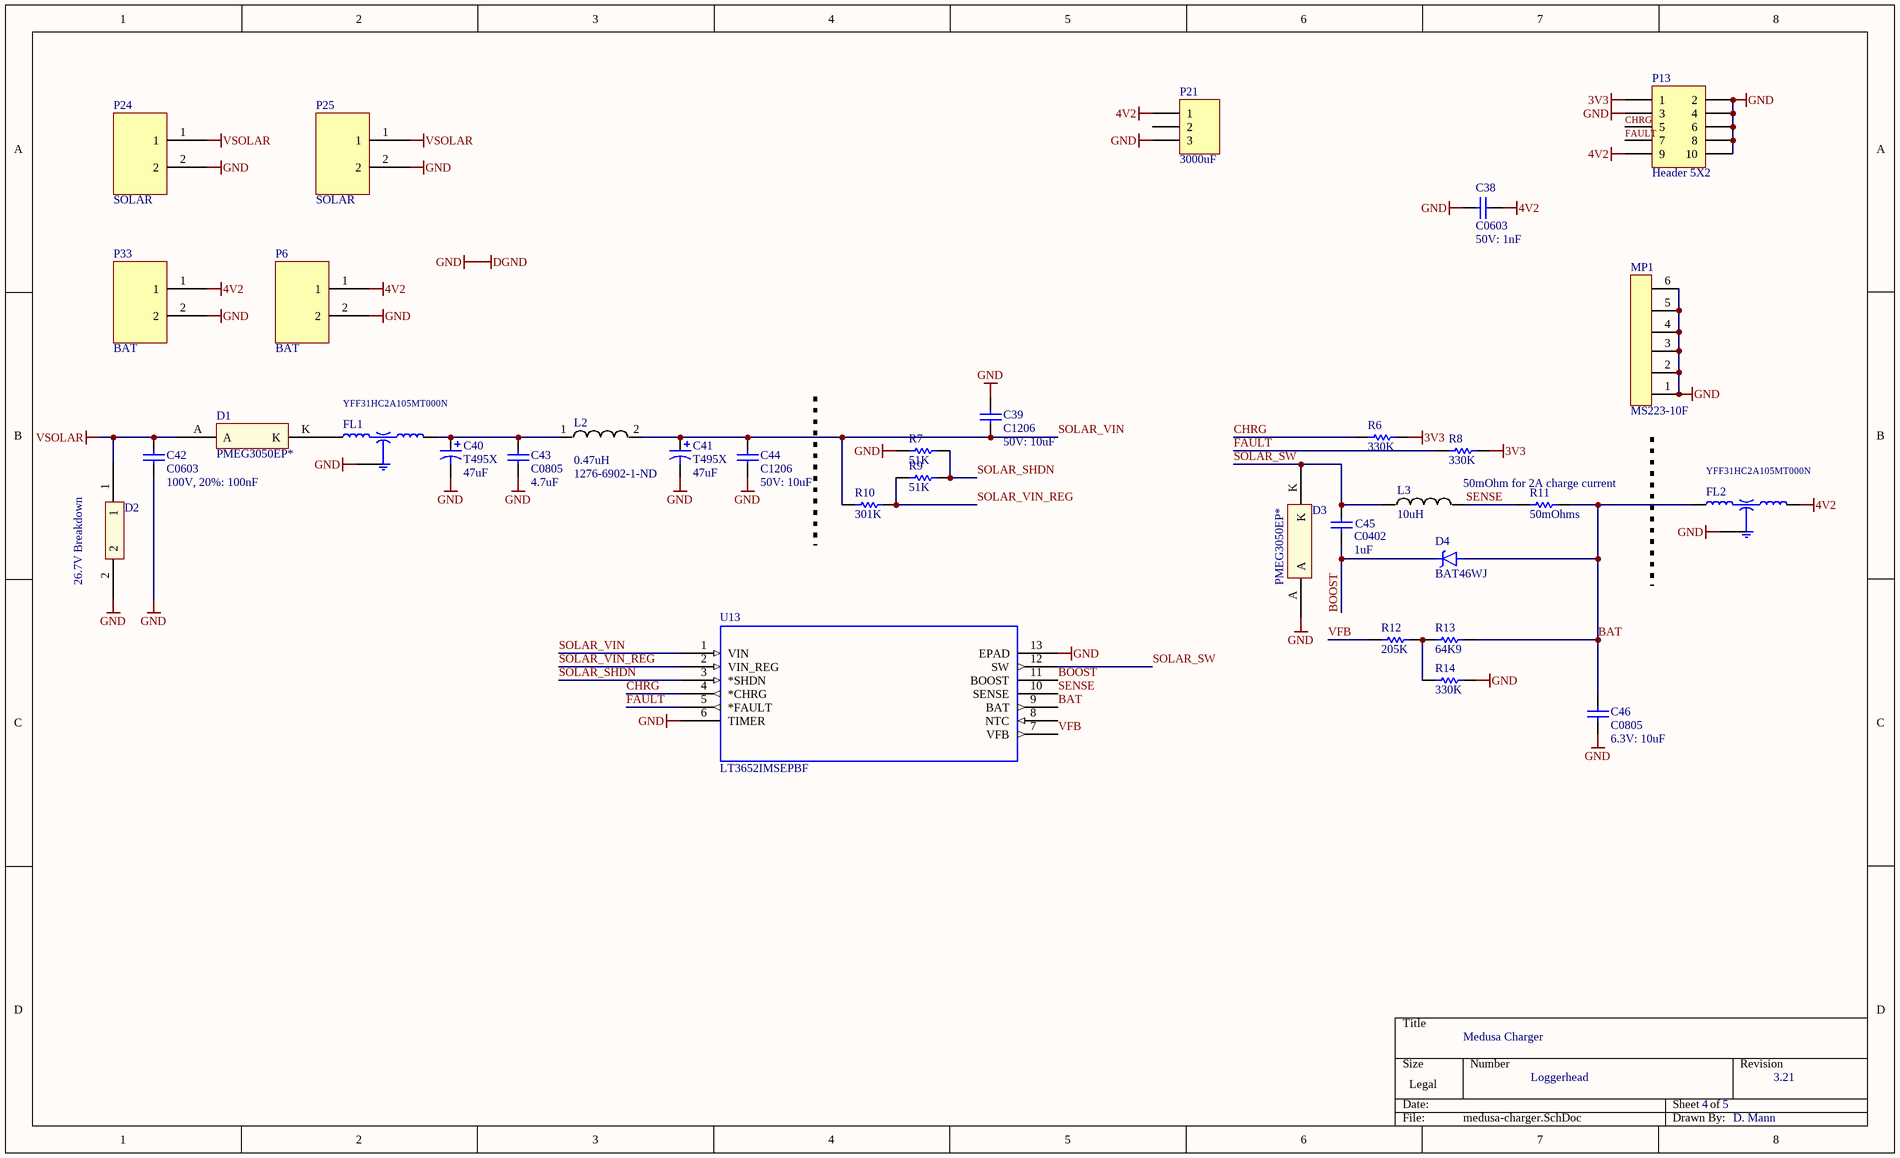
[diagram p4: medusa-charger.SchDoc]

### Parts
C38  C0603  50V: 1nF  [0603]
C39  C1206  50V: 10uF  [1206]
C40  T495X  value 47uF  [X]
C41  T495X  value 47uF  [X]
C42  C0603  100V, 20%: 100nF  [0603]
C43  C0805  value 4.7uF  [0805]
C44  C1206  50V: 10uF  [1206]
C45  C0402  value 1uF  [0402]
C46  C0805  6.3V: 10uF  [0805]
D1  PMEG3050EP*  [Diode_PMEG3050EP]
D2  26.7V Breakdown  [SMBJ24CA]
D3  PMEG3050EP*  [Diode_PMEG3050EP]
D4  BAT46WJ  [SOD-323]
FL1  YFF31HC2A105MT000N  [FIL_YFF31HC2A105MT000N]
FL2  YFF31HC2A105MT000N  [FIL_YFF31HC2A105MT000N]
L2  value 0.47uH  Supplier Part Number 1: 1276-6902-1-ND  [Inductor2016]  (hidden comment: Inductor2016)
L3  10uH  [Inductor0630CDMCD]
MP1  MS223-10F  [MS223-10F]
P6  BAT  [HDR_2x1_2mm]
P13  Header 5X2  [HDR2X5]
P21  3000uF  [HDR1X3]
P24  SOLAR  [HDR_2x1_2mm]
P25  SOLAR  [HDR_2x1_2mm]
P33  BAT  [HDR_2x1_2mm]
R6  330K  [3-0603]
R7  51K  [3-0603]
R8  330K  [3-0603]
R9  51K  [3-0603]
R10  301K  [3-0603]
R11  50mOhms  [8-1206]
R12  205K  [3-0603]
R13  64K9  [3-0603]
R14  330K  [3-0603]
U13  LT3652IMSEPBF  [MSOP-12_MSE]

### Nets
3V3: P13.1 R6.1 R8.1
4V2: C38.2 FL2.3(OUT/IN) P6.1 P13.9 P21.1 P33.1
DGND: C38.1 C39.1 C40.2 C41.2 C42.1 C43.1 C44.1 C46.1 D2.2 D3.A FL1.2_4(GND) FL2.2_4(GND) MP1.1 MP1.2 MP1.3 MP1.4 MP1.5 MP1.6 P6.2 P13.2 P13.3 P13.4 P13.6 P13.8 P13.10 P21.3 P24.2 P25.2 P33.2 R7.1 R14.1 U13.6(TIMER) U13.13(EPAD)  [also labelled GND]
VSOLAR: C42.2 D1.A D2.1 P24.1 P25.1
BAT: C46.2 D4.A FL2.1(IN/OUT) R11.2 R13.1 U13.9(BAT)
BOOST: C45.1 D4.C U13.11(BOOST)
CHRG: P13.5 R6.2 U13.4(*CHRG)
FAULT: P13.7 R8.2 U13.5(*FAULT)
SENSE: L3.2 R11.1 U13.10(SENSE)
SOLAR_SHDN: R7.2 R9.2 U13.3(*SHDN)
SOLAR_SW: C45.2 D3.K L3.1 U13.12(SW)
SOLAR_VIN: C39.2 C41.1 C44.2 L2.2 R10.1 U13.1(VIN)
SOLAR_VIN_REG: R9.1 R10.2 U13.2(VIN_REG)
VFB: R12.2 U13.7(VFB)
NetC40_1: C40.1 C43.2 FL1.3(OUT/IN) L2.1
NetD1_K: D1.K FL1.1(IN/OUT)
NetR12_1: R12.1 R13.2 R14.2

Not connected (* = marked no-connect by the designer): P21 2; U13 8(NTC)

### Notes on the sheet
- 50mOhm for 2A charge current
- Medusa Charger
- Loggerhead
- 4
- 5
- 3.21
- D. Mann

### Library data of the parts
C38 = C0603: as C34 on sheet medusa-ai-power; Published: 17-Jul-2002; LatestRevisionDate: 19-Mar-2004; LatestRevisionNote: Silkscreen size reduced.; DatasheetDocument: Mar-2001; PackageDocument: Mar-2001; PackageReference: 0603; Publisher: Altium Limited; Code_JEITA: 0603; Code_IPC: 1608 [0603]; ComponentLink1Description: Manufacturer Link; ComponentLink1URL: http://www.kemet.com/; ComponentLink2Description: Datasheet; ComponentLink2URL: http://www.kemet.com/kemet/web/homepage/kechome.nsf/vapubfilesname/F3102TA.pdf/$file/F3102TA.pdf
C39 C44 = C1206: Ceramic Chip Capacitor - Standard; Published: 17-Jul-2002; LatestRevisionDate: 19-Mar-2004; LatestRevisionNote: Silkscreen size reduced.; DatasheetDocument: Mar-2001; PackageDocument: Mar-2001; PackageReference: 1206; Publisher: Altium Limited; Code_JEITA: 1206; Code_IPC: 3216 [1206]; ComponentLink1Description: Manufacturer Link; ComponentLink1URL: http://www.kemet.com/; ComponentLink2Description: Datasheet; ComponentLink2URL: http://www.kemet.com/kemet/web/homepage/kechome.nsf/vapubfilesname/F3102TA.pdf/$file/F3102TA.pdf
C40 C41 = T495X: Solid Tantalum Chip Capacitor, Standard T495 Series - 35V 10%; PCB_Layout: Round Glue Pad at 2.9 ±0.1mm in diameter at KEMET's option; Published: 17-Jul-2002; LatestRevisionDate: 19-Mar-2004; LatestRevisionNote: Silkscreen dimensions re-sized.; DatasheetDocument: Mar-2001; PackageDocument: Mar-2001; PackageReference: X; Publisher: Altium Limited; Code_JEITA: 7343-43; ComponentLink1Description: Manufacturer Link; ComponentLink1URL: http://www.kemet.com/; ComponentLink2Description: Datasheet; ComponentLink2URL: http://www.kemet.com/kemet/web/homepage/kechome.nsf/vapubfilesname/F3102TA.pdf/$file/F3102TA.pdf
C42 = C0603: 100V 20%; Note: Footprint corresponds to dimensions for bulk cassette packaging. This case size has tightened tolerances.; Published: 17-Jul-2002; LatestRevisionDate: 19-Mar-2004; LatestRevisionNote: Silkscreen size reduced.; DatasheetDocument: Mar-2001; PackageDocument: Mar-2001; PackageReference: 0603; Publisher: Altium Limited; Code_JEITA: 0603; Code_IPC: 1608 [0603]; ComponentLink1Description: Manufacturer Link; ComponentLink1URL: http://www.kemet.com/; ComponentLink2Description: Datasheet; ComponentLink2URL: http://www.kemet.com/kemet/web/homepage/kechome.nsf/vapubfilesname/F3102TA.pdf/$file/F3102TA.pdf
C43 C46 = C0805: Ceramic Chip Capacitor - Standard; Note: Footprint corresponds to dimensions for bulk cassette packaging. This case size has tightened tolerances.; Published: 17-Jul-2002; LatestRevisionDate: 19-Mar-2004; LatestRevisionNote: Silkscreen size reduced.; DatasheetDocument: Mar-2001; PackageDocument: Mar-2001; PackageReference: 0805; Publisher: Altium Limited; Code_JEITA: 0805; Code_IPC: 2012[0805]; ComponentLink1Description: Manufacturer Link; ComponentLink1URL: http://www.kemet.com/; ComponentLink2Description: Datasheet; ComponentLink2URL: http://www.kemet.com/kemet/web/homepage/kechome.nsf/vapubfilesname/F3102TA.pdf/$file/F3102TA.pdf
C45 = C0402: as C1 on sheet Medusa-AI-ESP; Published: 17-Jul-2002; LatestRevisionDate: 19-Mar-2004; LatestRevisionNote: Silkscreen size reduced.; DatasheetDocument: Mar-2001; PackageDocument: Mar-2001; PackageReference: 0402; Publisher: Altium Limited; Code_JEITA: 0402; Code_IPC: 1005 [0402]; ComponentLink1Description: Manufacturer Link; ComponentLink1URL: http://www.kemet.com/; ComponentLink2Description: Datasheet; ComponentLink2URL: http://www.kemet.com/kemet/web/homepage/kechome.nsf/vapubfilesname/F3102TA.pdf/$file/F3102TA.pdf
D1 D3 = Diode_PMEG3050EP
D2 = SMBJ24CA
D4 = BAT46WJ: Diode Schottky 100V 250mA (DC) Surface Mount SOD-323F; MF: NXP Semiconductors; SnapEDA_Link: https://www.snapeda.com/parts/BAT46WJ/NXP%20Semiconductors/view-part/4222338/?ref=snap; Package: SOD-323 NXP Semiconductors; Availability: Bad; Price: None; MP: BAT46WJ; Value: *
FL1 FL2 = YFF31HC2A105MT000N: 1ÂµF Feed Through Capacitor 100V 6A 5mOhm 1206 (3216 Metric), 4 PC Pad; MF: TDK; Value: *; Availability: Good; Price: None; SnapEDA_Link: https://www.snapeda.com/parts/YFF31HC2A105MT000N/TDK-Lambda%20Americas%20Inc/view-part/566443/?ref=snap; Check_prices: https://www.snapeda.com/parts/YFF31HC2A105MT000N/TDK-Lambda%20Americas%20Inc/view-part/566443/?ref=eda; Purchase-URL: https://pricing.snapeda.com/search/part/YFF31HC2A105MT000N/?ref=eda; Package: 1206 TDK; MP: YFF31HC2A105MT000N
L3 = Inductor_0630CDMCD
MP1 = MS223-10F: RF Shield
P6 P24 P25 P33 = HDR_2x1_2mm
P13 = Header 5X2: Header, 5-Pin, Dual row; LatestRevisionDate: 17-Jul-2002; LatestRevisionNote: Re-released for DXP Platform.; Publisher: Altium Limited
P21 = Header 3: Header, 3-Pin; LatestRevisionDate: 17-Jul-2002; LatestRevisionNote: Re-released for DXP Platform.; Publisher: Altium Limited
R6-R10 R12-R14 = ERJ3EK: as R17 on sheet Medusa-AI-ESP; Published: 17-Dec-2003; LatestRevisionDate: 19-Mar-2004; LatestRevisionNote: Silkscreen size reduced.; PackageDocument: Mar-2003; PackageReference: 3-0603; Publisher: Altium Limited; Code_IPC: 1608 [0603]; ComponentLink1Description: Manufacturer Link; ComponentLink1URL: http://www.panasonic.com/industrial/components/resistive_products.htm; ComponentLink2Description: Datasheet; ComponentLink2URL: http://www.panasonic.com/industrial/components/pdf/AOA0000CE2.pdf
R11 = ERJ8EN: Precision Thick Film Chip Resistor, 10 Ohm to 2.2M Ohm Range, 1% Tolerance, 1206 Size, 0.125 W; Published: 17-Dec-2003; LatestRevisionDate: 19-Mar-2004; LatestRevisionNote: Silkscreen size reduced.; PackageDocument: Mar-2003; PackageReference: 8-1206; Publisher: Altium Limited; Code_IPC: 3216 [1206]; ComponentLink1Description: Manufacturer Link; ComponentLink1URL: http://www.panasonic.com/industrial/components/resistive_products.htm; ComponentLink2Description: Datasheet; ComponentLink2URL: http://www.panasonic.com/industrial/components/pdf/AOA0000CE2.pdf
U13 = LT3652IMSEPBF: Battery Charger Li-Ion 2000mA 4.2V Automotive 12-Pin MSOP EP Tube; MP: LT3652IMSE#PBF; MF: Analog Devices; Package: MSOP W/ EP-12 Analog Devices; Digi-Key_Purchase_URL: https://www.digikey.com/product-detail/en/linear-technology-analog-devices/LT3652IMSE-PBF/LT3652IMSE-PBF-ND/2237473?utm_source=snapeda&utm_medium=aggregator&utm_campaign=symbol; Value: *; Digi-Key_Part_Number: LT3652IMSE#PBF-ND; SnapEDA_Link: https://www.snapeda.com/parts/LT3652IMSE%23PBF/Analog%20Devices/view-part/4331669/?ref=snap
L2 = Inductor2016: Supplier 1: Digi-Key

## Nets that join several sheets
3V3: Medusa-AI-ESP (13 pins), medusa-ai-sensors (R5.2 R15.2 U11.3), medusa-charger (P13.1 R6.1 R8.1)
4V2: Medusa-AI-ESP (P15.2), medusa-ai-sensors (R3.2), medusa-charger (6 pins)
DGND: Medusa-AI-ESP (50 pins), medusa-ai-audio (P4.2), medusa-ai-power (15 pins), medusa-ai-sensors (13 pins), medusa-charger (33 pins)
VCC_GPS: medusa-ai-power (C26.1 U9.5), medusa-ai-sensors (C31.2 P9.2 U11.2 U11.17)
VCC_SD: Medusa-AI-ESP (P2.4), medusa-ai-power (C28.1 U10.5)
VCC_TILE: Medusa-AI-ESP (U14.2 U14.39 U14.41 U14.52), medusa-ai-power (5 pins)
BCLK: Medusa-AI-ESP (P11.3 U1.17), medusa-ai-audio (C8.2 U3.9)
GPS_EN: Medusa-AI-ESP (P16.6 U1.32), medusa-ai-power (U9.3)
GPS_PIN: Medusa-AI-ESP (P16.9 U1.35), medusa-ai-sensors (P9.8 U11.19)
HYDRO_EN: Medusa-AI-ESP (P11.5 U1.19), medusa-ai-audio (U2.3 U4.3 U5.3)
I2SDOUT: Medusa-AI-ESP (P11.4 U1.18), medusa-ai-audio (C20.1 U3.11)
LRCLK: Medusa-AI-ESP (P11.12 U1.26), medusa-ai-audio (C18.1 U3.10)
MCLK: Medusa-AI-ESP (P3.9 U1.9), medusa-ai-audio (U3.5)
PPS: medusa-ai-audio (P10.1), medusa-ai-sensors (P9.1 R22.2 R23.1)
RX_GPS: Medusa-AI-ESP (P16.7 U1.33), medusa-ai-sensors (C33.2 P9.5)
SCL: Medusa-AI-ESP (5 pins), medusa-ai-audio (U3.4), medusa-ai-sensors (R15.1 U11.12)
SD_EN: Medusa-AI-ESP (P3.6 U1.6), medusa-ai-power (U10.3)
SDA: Medusa-AI-ESP (5 pins), medusa-ai-audio (U3.3), medusa-ai-sensors (R5.1 U11.9)
TILE_EN: Medusa-AI-ESP (P11.6 U1.20), medusa-ai-power (R16.1 U15.5)
TX_GPS: Medusa-AI-ESP (P16.8 U1.34), medusa-ai-sensors (C32.2 P9.4)
VIN: Medusa-AI-ESP (9 pins), medusa-ai-audio (6 pins), medusa-ai-power (7 pins)